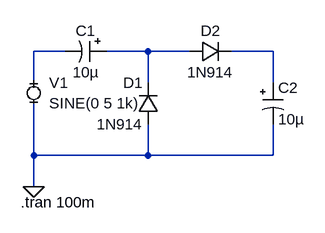
[diagram p0: schematic подвоювач.asc]
подвоювач.asc, the LTspice schematic file:
Version 4
SHEET 1 880 680
WIRE 112 128 64 128
WIRE 240 128 176 128
WIRE 304 128 240 128
WIRE 432 128 368 128
WIRE 64 176 64 128
WIRE 240 176 240 128
WIRE 432 176 432 128
WIRE 64 288 64 208
WIRE 240 288 240 240
WIRE 240 288 64 288
WIRE 432 288 432 240
WIRE 432 288 240 288
WIRE 64 336 64 288
FLAG 64 336 0
SYMBOL MiniSyms4\\voltage- 64 192 R0
WINDOW 123 0 0 Left 2
WINDOW 39 0 0 Left 2
SYMATTR InstName V1
SYMATTR Value SINE(0 5 1k)
SYMBOL polcap 176 112 R90
WINDOW 0 0 32 VBottom 2
WINDOW 3 32 32 VTop 2
SYMATTR InstName C1
SYMATTR Value 10µ
SYMATTR Description Capacitor
SYMATTR Type cap
SYMATTR SpiceLine V=16 Irms=35m Rser=2.8 Lser=0 mfg="Nichicon" pn="UPR1C100MAH" type="Al electrolytic"
SYMBOL diode 256 240 R180
WINDOW 0 24 64 Left 2
WINDOW 3 24 0 Left 2
SYMATTR InstName D1
SYMATTR Value 1N914
SYMBOL diode 304 144 R270
WINDOW 0 32 32 VTop 2
WINDOW 3 0 32 VBottom 2
SYMATTR InstName D2
SYMATTR Value 1N914
SYMBOL polcap 416 176 R0
WINDOW 3 24 56 Left 2
SYMATTR InstName C2
SYMATTR Value 10µ
SYMATTR Description Capacitor
SYMATTR Type cap
SYMATTR SpiceLine V=16 Irms=35m Rser=2.8 Lser=0 mfg="Nichicon" pn="UPR1C100MAH" type="Al electrolytic"
TEXT 44 360 Left 2 !.tran 100m

The netlist it stands for:
* подвоювач.asc
V1 N001 0 SINE(0 5 1k)
C1 N002 N001 10µ V=16 Irms=35m Rser=2.8 Lser=0 mfg="Nichicon" pn="UPR1C100MAH" type="Al electrolytic"
D1 0 N002 1N914
D2 N002 N003 1N914
C2 N003 0 10µ V=16 Irms=35m Rser=2.8 Lser=0 mfg="Nichicon" pn="UPR1C100MAH" type="Al electrolytic"
.model D D
.lib standard.dio
.tran 100m
.backanno
.end